# EAGLE design poppy (EAGLE 6.4)
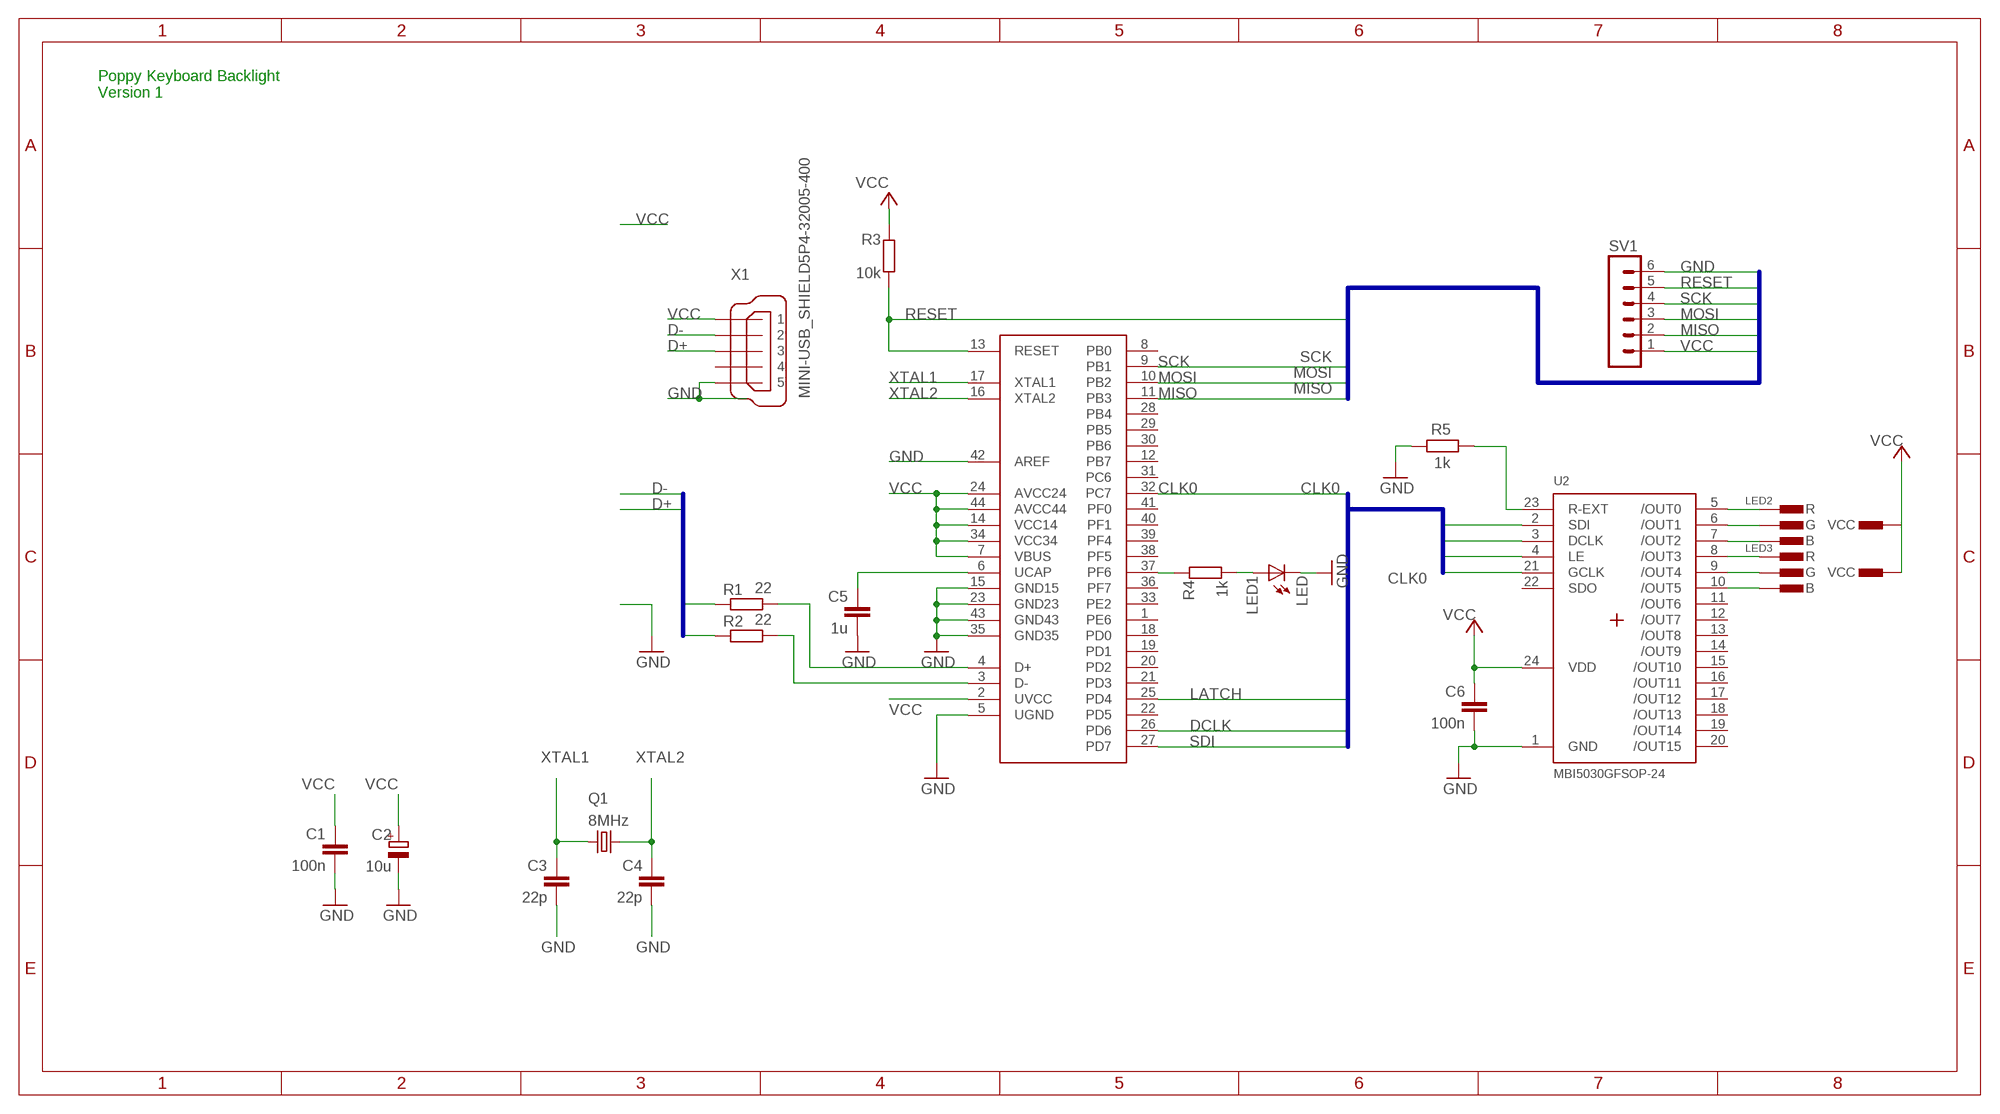
[diagram p0: schematic, sheet 1]

## Parts
C1  100n  C-EUC1206K  [C1206K]
C2  10u  CPOL-EU153CLV-0807  [153CLV-0807]
C3  22p  C-EUC1206K  [C1206K]
C4  22p  C-EUC1206K  [C1206K]
C5  1u  C-EUC1206K  [C1206K]
C6  100n  C-EUC1206K  [C1206K]
LED1  LED  LEDCHIPLED_0805  [CHIPLED_0805]
LED2  CON-RGB-LED-EXT  [CON-RGB-LED-TH-EXT]
LED3  CON-RGB-LED-EXT  [CON-RGB-LED-TH-EXT]
Q1  8MHz  CSM-7X-DU  [CSM-7X-DU]
R1  22  R-EU_R1206  [R1206]
R2  22  R-EU_R1206  [R1206]
R3  10k  R-EU_R1206  [R1206]
R4  1k  R-EU_R1206  [R1206]
R5  1k  R-EU_R1206  [R1206]
SV1  MA06-1  [MA06-1]
U1  ATMEGA16U4TQFP44  [ATMEGA16U4_TQFP]
U2  MBI5030GFSOP-24  [_LEDDRIVERS_SOP24-300-1.00]
X1  MINI-USB_SHIELD5P4-32005-400  [32005-400]

## Nets
CLK0: U1.32(PC7) U2.21(GCLK)
D+: R1.2 X1.3
D-: R2.2 X1.2
DCLK: U1.26(PD6) U2.3(DCLK)
GND: C1.2 C2.- C3.2 C4.2 C5.2 C6.2 LED1.C R5.1 SV1.6 U1.5(UGND) U1.15(GND15) U1.23(GND23) U1.35(GND35) U1.42(AREF) U1.43(GND43) U2.1(GND) X1.5
LATCH: U1.25(PD4) U2.4(LE)
MISO: SV1.2 U1.11(PB3)
MOSI: SV1.3 U1.10(PB2)
N$1: R4.2 U1.37(PF6)
N$2: R5.2 U2.23(R-EXT)
N$3: LED2.3.R(R) U2.5(/OUT0)
N$4: C5.1 U1.6(UCAP)
N$5: LED2.2.G(G) U2.6(/OUT1)
N$6: LED2.1.B(B) U2.7(/OUT2)
N$7: LED1.A R4.1
N$9: R1.1 U1.4(D+)
N$10: R2.1 U1.3(D-)
N$11: LED3.3.R(R) U2.8(/OUT3)
N$12: LED3.2.G(G) U2.9(/OUT4)
N$13: LED3.1.B(B) U2.10(/OUT5)
RESET: R3.1 SV1.5 U1.13(RESET)
SCK: SV1.4 U1.9(PB1)
SDI: U1.27(PD7) U2.2(SDI)
VCC: C1.1 C2.+ C6.1 LED2.4.VCC(VCC) LED3.4.VCC(VCC) R3.2 SV1.1 U1.2(UVCC) U1.7(VBUS) U1.14(VCC14) U1.24(AVCC24) U1.34(VCC34) U1.44(AVCC44) U2.24(VDD) X1.1
XTAL1: C3.1 Q1.1 U1.17(XTAL1)
XTAL2: C4.1 Q1.2 U1.16(XTAL2)
Unconnected: U1.1(PE6) U1.8(PB0) U1.12(PB7) U1.18(PD0) U1.19(PD1) U1.20(PD2) U1.21(PD3) U1.22(PD5) U1.28(PB4) U1.29(PB5) U1.30(PB6) U1.31(PC6) U1.33(PE2) U1.36(PF7) U1.38(PF5) U1.39(PF4) U1.40(PF1) U1.41(PF0) U2.11(/OUT6) U2.12(/OUT7) U2.13(/OUT8) U2.14(/OUT9) U2.15(/OUT10) U2.16(/OUT11) U2.17(/OUT12) U2.18(/OUT13) U2.19(/OUT14) U2.20(/OUT15) U2.22(SDO) X1.4 X1.M1(S1) X1.M2(S2) X1.M3(S3) X1.M4(S4)

## Buses
D+,D-
MISO,MOSI,SCK,RESET,VCC,GND
SDI,LATCH,DCLK,CLK0

## Notes on the sheet
- Poppy Keyboard Backlight
  Version 1

## Library data of the parts
C1 C3-C6 = resistor:C-EU: CAPACITOR, European symbol
C2 = resistor:CPOL-EU: POLARIZED CAPACITOR, European symbol
LED1 = led:LED: LED OSRAM: - CHIPLED LG R971, LG N971, LY N971, LG Q971, LY Q971, LO R971, LY R971 LH N974, LH R974 LS Q976, LO Q976, LY Q976 LO Q996 - Hyper CHIPLED LW Q18S LB Q993, LB Q99A, LB R99A - SideLED LS A670, LO A670, LY A670, LG A670, LP A670 LB A673, LV A673, LT A673, LW A673 LH A674 LY A675 LS A676, LA A676, LO A676, LY A676, LW A676 LS A679, LY A679, LG A679 - Hyper Micro SIDELED® LS Y876, LA Y876, LO Y876, LY Y876 LT Y87S - SmartLED LW L88C, LW L88S LB L89C, LB L89S, LG L890 LS L89K, LO L89K, LY L89K LS L896, LA L896, LO L896, LY L896 - TOPLED LS T670, LO T670, LY T670, LG T670, LP T670 LSG T670, LSP T670, LSY T670, LOP T670, LYG T670 LG T671, LOG T671, LSG T671 LB T673, LV T673, LT T673, LW T673 LH T674 LS T676, LA T676, LO T676, LY T676, LB T676, LH T676, LSB T676, LW T676 LB T67C, LV T67C, LT T67C, LS T67K, LO T67K, LY T67K, LW E67C LS E67B, LA E67B, LO E67B, LY E67B, LB E67C, LV E67C, LT E67C LW T67C LS T679, LY T679, LG T679 LS T770, LO T770, LY T770, LG T770, LP T770 LB T773, LV T773, LT T773, LW T773 LH T774 LS E675, LA E675, LY E675, LS T675 LS T776, LA T776, LO T776, LY T776, LB T776 LHGB T686 LT T68C, LB T68C - Hyper Mini TOPLED® LB M676 - Mini TOPLED Santana® LG M470 LS M47K, LO M47K, LY M47K Source: http://www.osram.convergy.de LUXEON: - LUMILED® LXK2-PW12-R00, LXK2-PW12-S00, LXK2-PW14-U00, LXK2-PW14-V00 LXK2-PM12-R00, LXK2-PM12-S00, LXK2-PM14-U00 LXK2-PE12-Q00, LXK2-PE12-R00, LXK2-PE12-S00, LXK2-PE14-T00, LXK2-PE14-U00 LXK2-PB12-K00, LXK2-PB12-L00, LXK2-PB12-M00, LXK2-PB14-N00, LXK2-PB14-P00, LXK2-PB14-Q00 LXK2-PR12-L00, LXK2-PR12-M00, LXK2-PR14-Q00, LXK2-PR14-R00 LXK2-PD12-Q00, LXK2-PD12-R00, LXK2-PD12-S00 LXK2-PH12-R00, LXK2-PH12-S00 LXK2-PL12-P00, LXK2-PL12-Q00, LXK2-PL12-R00 Source: www.luxeon.com KINGBRIGHT: KA-3528ASYC Source: www.kingbright.com
LED2 LED3 = _led-rgb:CON-RGB-LED
Q1 = crystal:CSM-7X-DU: SMD CRYSTAL Source: www.ecsxtal.com .. Crystal 3.6864MHz CSM_7X_DU.PDF; OC_FARNELL: unknown; OC_NEWARK: unknown
R1-R5 = resistor:R-EU_: RESISTOR, European symbol
SV1 = con-lstb:MA06-1: PIN HEADER; OC_FARNELL: unknown; OC_NEWARK: unknown
U1 = p1poppy:ATMEGA16U4
U2 = p1poppy:MBI5030GF
X1 = con-cypressindustries:MINI-USB_SHIELD5P4-: MINI USB-B R/A W/O POST 5 pol. Source: www.cypressindustries.com; OC_FARNELL: unknown; OC_NEWARK: unknown

## Net classes
0 default: clearance 0.355 mm

## Board
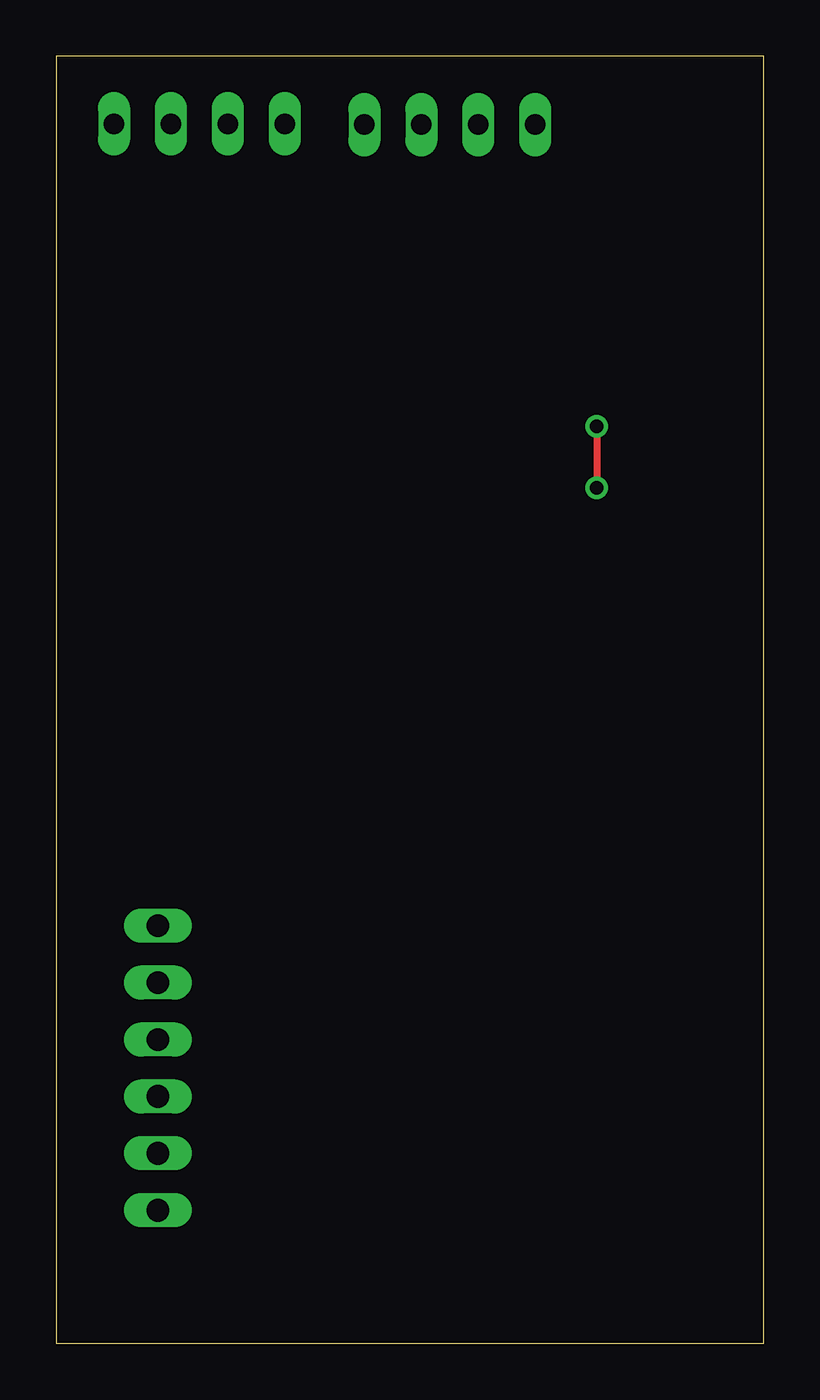
[diagram p1: board, top side]
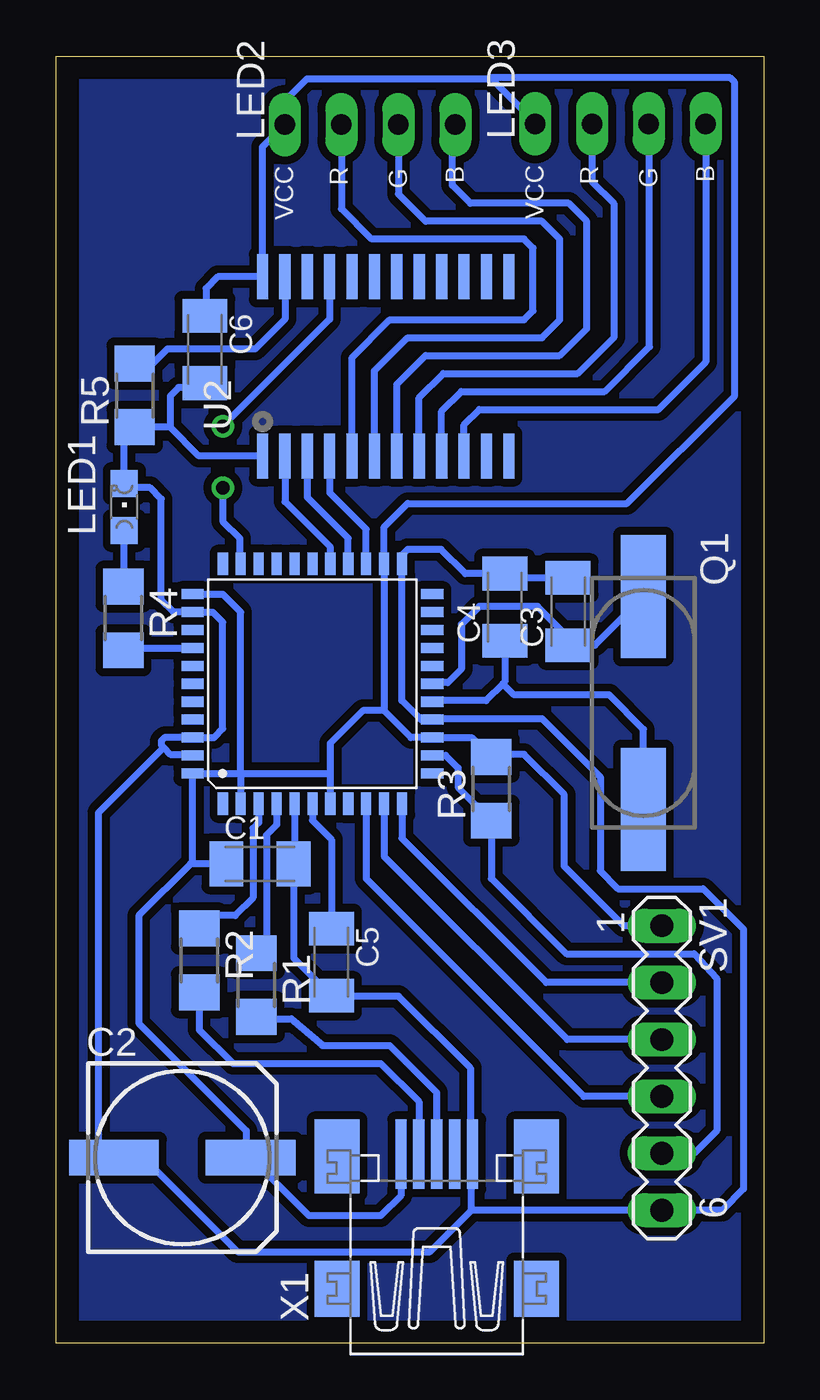
[diagram p2: board, bottom side, seen from below]

Size 31.6 x 57.48 mm. Coordinates in mm from the lower left corner, seen from the top.
Outline: 0,0 31.6,0 31.6,57.48 0,57.48 0,0
Copper layers (1*16): Top 0.035mm / dielectric 1.5mm / Bottom 0.035mm
Design rules "default *": minimum track width 10mil, minimum drill 24mil, track to track 8mil, track to pad 8mil, pad to pad 8mil, via to via 8mil, smd to smd 8mil, copper to edge 40mil, drill to drill 8mil, minimum pad ring 10mil, minimum via ring 8mil, stop-mask expansion 4mil, vias tented up to drill 0mil, thermal gap 10mil

### Footprints (pad centres in the part's own frame; a part is rotated, then mirrored left to right if it is on the bottom)
C1206K = smd 1.5 x 2: 1 -1.5,0; 2 1.5,0
153CLV-0807 = smd 4 x 1.6: + 3.05,0; - -3.05,0
CHIPLED_0805 = smd 1.2 x 1.2: A 0,-1.05; C 0,1.05
CON-RGB-LED-TH-EXT = drill 0.914 long: 1.B 0,-3.81; 2.G 0,-1.27; 3.R 0,1.27; 4.VCC 0,3.81
CSM-7X-DU = smd 5.5 x 2: 1 -4.75,0; 2 4.75,0
R1206 = smd 1.6 x 1.803: 1 -1.422,0; 2 1.422,0
MA06-1 = drill 1.016 long: 1 -6.35,0; 2 -3.81,0; 3 -1.27,0; 4 1.27,0; 5 3.81,0; 6 6.35,0
ATMEGA16U4_TQFP = smd 1 x 0.45: 1 -5.35,4; 2 -5.35,3.2; 3 -5.35,2.4; 4 -5.35,1.6; 5 -5.35,0.8; 6 -5.35,0; 7 -5.35,-0.8; 8 -5.35,-1.6; 9 -5.35,-2.4; 10 -5.35,-3.2; 11 -5.35,-4; 23 5.35,-4; 24 5.35,-3.2; 25 5.35,-2.4; 26 5.35,-1.6; 27 5.35,-0.8; 28 5.35,0; 29 5.35,0.8; 30 5.35,1.6; 31 5.35,2.4; 32 5.35,3.2; 33 5.35,4 | smd 0.45 x 1: 12 -4,-5.35; 13 -3.2,-5.35; 14 -2.4,-5.35; 15 -1.6,-5.35; 16 -0.8,-5.35; 17 0,-5.35; 18 0.8,-5.35; 19 1.6,-5.35; 20 2.4,-5.35; 21 3.2,-5.35; 22 4,-5.35; 34 4,5.35; 35 3.2,5.35; 36 2.4,5.35; 37 1.6,5.35; 38 0.8,5.35; 39 0,5.35; 40 -0.8,5.35; 41 -1.6,5.35; 42 -2.4,5.35; 43 -3.2,5.35; 44 -4,5.35
_LEDDRIVERS_SOP24-300-1.00 = smd 0.5 x 2: 1 -5.48,-4.08; 2 -4.48,-4.08; 3 -3.48,-4.08; 4 -2.48,-4.08; 5 -1.48,-4.08; 6 -0.48,-4.08; 7 0.52,-4.08; 8 1.52,-4.08; 9 2.52,-4.08; 10 3.52,-4.08; 11 4.52,-4.08; 12 5.52,-4.08; 13 5.52,3.92; 14 4.52,3.92; 15 3.52,3.92; 16 2.52,3.92; 17 1.52,3.92; 18 0.52,3.92; 19 -0.48,3.92; 20 -1.48,3.92; 21 -2.48,3.92; 22 -3.48,3.92; 23 -4.48,3.92; 24 -5.48,3.92
32005-400 = smd 3.1 x 0.5: 1 3,1.6; 2 3,0.8; 3 3,0; 4 3,-0.8; 5 3,-1.6 | smd 2.5 x 2: M1 -3,-4.45; M2 -3,4.45 | smd 3.3 x 2: M3 2.9,4.45; M4 2.9,-4.45

### Placement (x,y rotation side)
C1  22.49,21.41 0 bottom
C2  25.96,8.3 0 bottom
C3  8.73,32.67 90 bottom
C4  11.56,32.87 90 bottom
C5  19.3,17.02 270 bottom
C6  24.95,44.38 270 bottom
LED1  28.55,37.34 0 bottom
LED2  17.58,54.41 90 bottom
LED3  6.4,54.45 90 bottom
Q1  5.37,28.59 270 bottom
R1  22.65,16 270 bottom
R2  25.2,17.1 270 bottom
R3  12.16,24.76 90 bottom
R4  28.59,32.37 270 bottom
R5  28.09,42.32 90 bottom
SV1  4.55,12.3 270 bottom
U1  20.15,29.45 90 bottom
U2  16.9,43.7 0 bottom
X1  14.6,5.45 90 bottom

### Tracks (layer width: path | path; a pad name or v marks a point on that pad's centre or on a via)
CLK0  (via drill 0.6)
  Top 0.305: v24.15,40.95 v24.15,38.2
  Bottom 0.305: U2.21 19.38,45.72 v24.15,40.95 | v24.15,38.2 24.15,36.7 23.4,35.95 23.4,34.85 U1.32
D+
  Bottom 0.305: 14.7,8.55 X1.3 14.6,11.2 16.7,13.3 19.7,13.3 21.1,14.5 22.57,14.5 R1.2
D-
  Bottom 0.305: R2.2 25.2,14 23.7,12.5 17.1,12.5 15.4,10.8 X1.2 15.5,8.55
DCLK
  Bottom 0.305: U2.3 20.38,37.78 18.55,35.95 U1.26
GND
  Bottom 0.305: 28.04,40.95 R5.1 | R5.1 28.55,40.44 LED1.C 28.36,38.2 27.4,38.2 26.9,37.7 26.9,33.2 26.35,32.65 U1.35 24.6,32.65 24.15,32.2 24.15,27.45 24.55,27.05 U1.42 26.75,27.05 26.9,26.9 26.9,26.7 26.8,26.6 | U2.1 25.22,39.62 26.5,40.9 | C6.2 25.15,42.67 26.12,42.67 26.5,42.3 26.5,40.9 | C3.2 11.37,34.17 C4.2 13.32,34.37 14.4,35.45 15.9,35.45 16.15,35.2 U1.23 16.15,28.7 15.35,27.9 | U1.15 15.3,27.85 15.35,27.9 | 15.35,27.9 9.9,27.9 7.3,25.3 7.3,21.1 6.5,20.3 2.7,20.3 0.9,18.5 0.9,6.9 1.85,5.95 SV1.6 13.05,5.95 | 13.05,5.95 14.9,4.1 23.5,4.1 27.57,8.17 27.87,8.17 27.9,8.2 28.91,8.2 C2.- 29.7,8.99 29.7,23.7 26.8,26.6 | 13.1,8.35 X1.5 | C1.2 20.99,21.59 20.9,21.5 | 20.95,21.65 C1.2 | 26.8,26.6 26.5,26.3 25.55,26.3 U1.43 | 13.05,5.95 13.05,8.4 X1.5 | X1.5 13.1,8.55 13.1,12.3 16.3,15.5 19.28,15.5 C5.2 20.99,17.21 C1.2 | U1.5 20.95,21.45 C1.2 | 26.5,40.9 R5.1
LATCH
  Bottom 0.305: U2.4 19.38,37.98 17.75,36.35 U1.25
MISO
  Bottom 0.305: SV1.2 9.71,16.11 16.15,22.55 U1.11
MOSI
  Bottom 0.305: SV1.3 8.77,13.57 16.95,21.75 U1.10
N$1
  Bottom 0.305: R4.2 28.74,31.05 U1.37
N$2
  Bottom 0.305: U2.23 21.38,45.72 22.7,44.4 26.63,44.4 27.29,43.75 R5.2
N$3
  Bottom 0.305: U2.5 18.38,44.02 16.7,45.7 10.7,45.7 10.3,46.1 10.3,48.9 10.7,49.3 17.5,49.3 18.85,50.65 LED2.3.R
N$4
  Bottom 0.305: U1.6 20.15,23.35 19.3,22.5 C5.1
N$5
  Bottom 0.305: U2.6 17.38,43.42 15.9,44.9 9.9,44.9 9.1,45.7 9.1,49.3 9.9,50.1 15.1,50.1 16.31,51.31 LED2.2.G
N$6
  Bottom 0.305: U2.7 16.38,42.82 15.1,44.1 9.1,44.1 7.9,45.3 7.9,50.1 8.7,50.9 13.1,50.9 13.9,51.7 13.9,54.28 LED2.1.B
N$7
  Bottom 0.305: R4.1 28.55,33.58 LED1.A
N$9
  Bottom 0.305: U1.4 21.75,23.15 22.2,22.7 22.2,18.07 R1.1
N$10
  Bottom 0.305: U1.3 22.55,23.25 22.8,23 22.8,19.9 23.6,19.1 24.62,19.1 R2.1
N$11
  Bottom 0.305: U2.8 15.38,42.22 14.3,43.3 8.3,43.3 6.7,44.9 6.7,50.9 7.67,51.87 LED3.3.R
N$12
  Bottom 0.305: U2.9 14.38,41.62 13.5,42.5 7.1,42.5 5.1,44.5 5.1,54.42 LED3.2.G
N$13
  Bottom 0.305: U2.10 13.38,41.02 12.7,41.7 4.7,41.7 2.59,43.81 LED3.1.B
N$14
  pour Bottom: 0.7,57.3 0.7,-0.5 31.5,-0.5 31.5,57.3
RESET
  Bottom 0.305: U1.13 14.2,26.25 13.65,25.7 13.65,24.83 R3.1 12.16,20.76 8.8,17.4 3.1,17.4 2.1,16.3 2.1,9.5 3.1,8.5 4.16,8.5 SV1.5
SCK
  Bottom 0.305: U1.9 17.75,20.75 8.03,11.03 SV1.4
SDI
  Bottom 0.305: U2.2 21.38,37.58 19.35,35.55 U1.27
VCC
  Bottom 0.305: 23.35,25.45 U1.2 | 23.35,25.45 U1.44 25.5,21.41 C1.1 25.59,21.41 27.9,19.1 27.9,14.3 23.1,9.5 23.1,8.49 C2.+ 20.31,5.7 17.1,5.7 16.2,6.6 X1.1 | 16.95,28.25 15.75,27.05 U1.14 13.03,27.05 R3.2 12.04,26.3 10.7,26.3 8.9,24.5 8.9,21.3 6.25,18.65 SV1.1 | 16.95,28.25 U1.24 16.95,36.45 15.9,37.5 6.1,37.5 1.3,42.3 1.3,56.3 1.5,56.5 12.25,56.5 12.3,56.45 | 23.35,25.45 23.35,32.65 24.15,33.45 U1.34 | 16.95,28.25 17.9,28.25 19.35,26.8 19.35,25.45 | U1.7 19.35,25.45 | 23.35,25.45 19.35,25.45 | LED3.4.VCC 10.21,54.51 12.15,56.45 12.3,56.45 | 12.3,56.45 20.4,56.45 21.39,55.46 LED2.4.VCC 22.38,53.42 U2.24 24.38,47.62 24.9,47.1 24.9,45.92 C6.1
XTAL1
  Bottom 0.305: Q1.1 7.54,31.17 C3.1 8.73,31.54 10.1,32.9 12.7,32.9 13.5,32.1 13.5,30.1 14.1,29.5 14.75,29.5 U1.17
XTAL2
  Bottom 0.305: C4.1 11.56,29.54 11.65,29.45 | 11.65,29.45 12.4,28.7 14.75,28.7 U1.16 | Q1.2 5.37,27.42 6.9,28.95 11.15,28.95 11.65,29.45